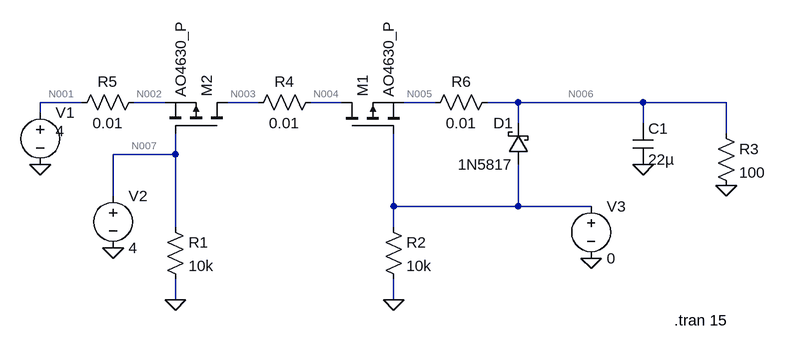
[diagram p0: schematic power.asc]
power.asc, the LTspice schematic file:
Version 4
SHEET 1 1456 680
WIRE -160 112 -224 112
WIRE -32 112 -80 112
WIRE 112 112 64 112
WIRE 240 112 192 112
WIRE 384 112 336 112
WIRE 512 112 464 112
WIRE 704 112 512 112
WIRE 832 112 704 112
WIRE -224 128 -224 112
WIRE 512 144 512 112
WIRE 704 144 704 112
WIRE 832 160 832 112
WIRE -16 192 -16 160
WIRE -16 192 -112 192
WIRE -112 256 -112 192
WIRE 320 272 320 160
WIRE 512 272 512 208
WIRE 512 272 320 272
WIRE 624 272 512 272
WIRE -16 304 -16 192
WIRE 320 304 320 272
WIRE -16 416 -16 384
WIRE 320 416 320 384
FLAG -112 336 0
FLAG -224 208 0
FLAG 320 416 0
FLAG -16 416 0
FLAG 624 352 0
FLAG 832 240 0
FLAG 704 208 0
SYMBOL pmos 240 160 R270
SYMATTR InstName M1
SYMATTR Value AO4630_P
SYMBOL voltage -224 112 R0
WINDOW 3 24 44 Left 2
WINDOW 123 0 0 Left 0
WINDOW 39 0 0 Left 0
SYMATTR InstName V1
SYMATTR Value 4
SYMBOL voltage -112 240 R0
WINDOW 123 0 0 Left 0
WINDOW 39 0 0 Left 0
SYMATTR InstName V2
SYMATTR Value 4
SYMBOL res -32 288 R0
SYMATTR InstName R1
SYMATTR Value 10k
SYMBOL res 304 288 R0
SYMATTR InstName R2
SYMATTR Value 10k
SYMBOL schottky 528 208 R180
WINDOW 0 24 64 Left 2
WINDOW 3 24 0 Left 2
SYMATTR InstName D1
SYMATTR Value 1N5817
SYMATTR Description Diode
SYMATTR Type diode
SYMBOL voltage 624 256 R0
WINDOW 123 0 0 Left 0
WINDOW 39 0 0 Left 0
SYMATTR InstName V3
SYMATTR Value 0
SYMBOL res 816 144 R0
SYMATTR InstName R3
SYMATTR Value 100
SYMBOL pmos 64 160 M270
SYMATTR InstName M2
SYMATTR Value AO4630_P
SYMBOL cap 688 144 R0
SYMATTR InstName C1
SYMATTR Value 22µ
SYMBOL res 208 96 R90
WINDOW 0 0 56 VBottom 2
WINDOW 3 32 56 VTop 2
SYMATTR InstName R4
SYMATTR Value 0.01
SYMBOL res -64 96 R90
WINDOW 0 0 56 VBottom 2
WINDOW 3 32 56 VTop 2
SYMATTR InstName R5
SYMATTR Value 0.01
SYMBOL res 480 96 R90
WINDOW 0 0 56 VBottom 2
WINDOW 3 32 56 VTop 2
SYMATTR InstName R6
SYMATTR Value 0.01
TEXT 752 448 Left 2 !.tran 15

The netlist it stands for:
* power.asc
M1 N004 N008 N005 N005 AO4630_P
V1 N001 0 4
V2 N007 0 4
R1 N007 0 10k
R2 N008 0 10k
D1 N008 N006 1N5817
V3 N008 0 0
R3 N006 0 100
M2 N003 N007 N002 N002 AO4630_P
C1 N006 0 22µ
R4 N004 N003 0.01
R5 N002 N001 0.01
R6 N006 N005 0.01
.model D D
.lib standard.dio
.model NMOS NMOS
.model PMOS PMOS
.lib standard.mos
.tran 15
.backanno
.end

* Results of the author's LTspice run, read from the files saved beside the schematic
* Operating Point, zero values left out:
*   V(n004) = 23.05 mV
*   V(n005) = 76.54 nV
*   V(n001) = 4 V
*   V(n007) = 4 V
*   V(n006) = 76.53 nV
*   V(n003) = 23.05 mV
*   V(n002) = 4 V
*   Id(M2) = -829.6 pA
*   Is(M2) = 829.6 pA
*   Id(M1) = 833.6 pA
*   Is(M1) = -833.6 pA
*   I(D1) = -68.31 pA
*   I(R6) = -833.6 pA
*   I(R5) = -833.6 pA
*   I(R4) = -833.6 pA
*   I(R3) = 765.3 pA
*   I(R1) = 400 µA
*   I(V3) = 68.31 pA
*   I(V2) = -400 µA
*   I(V1) = -833.7 pA